# EAGLE design Wifi Topside Adapter 0.1 (EAGLE 6.5.0)
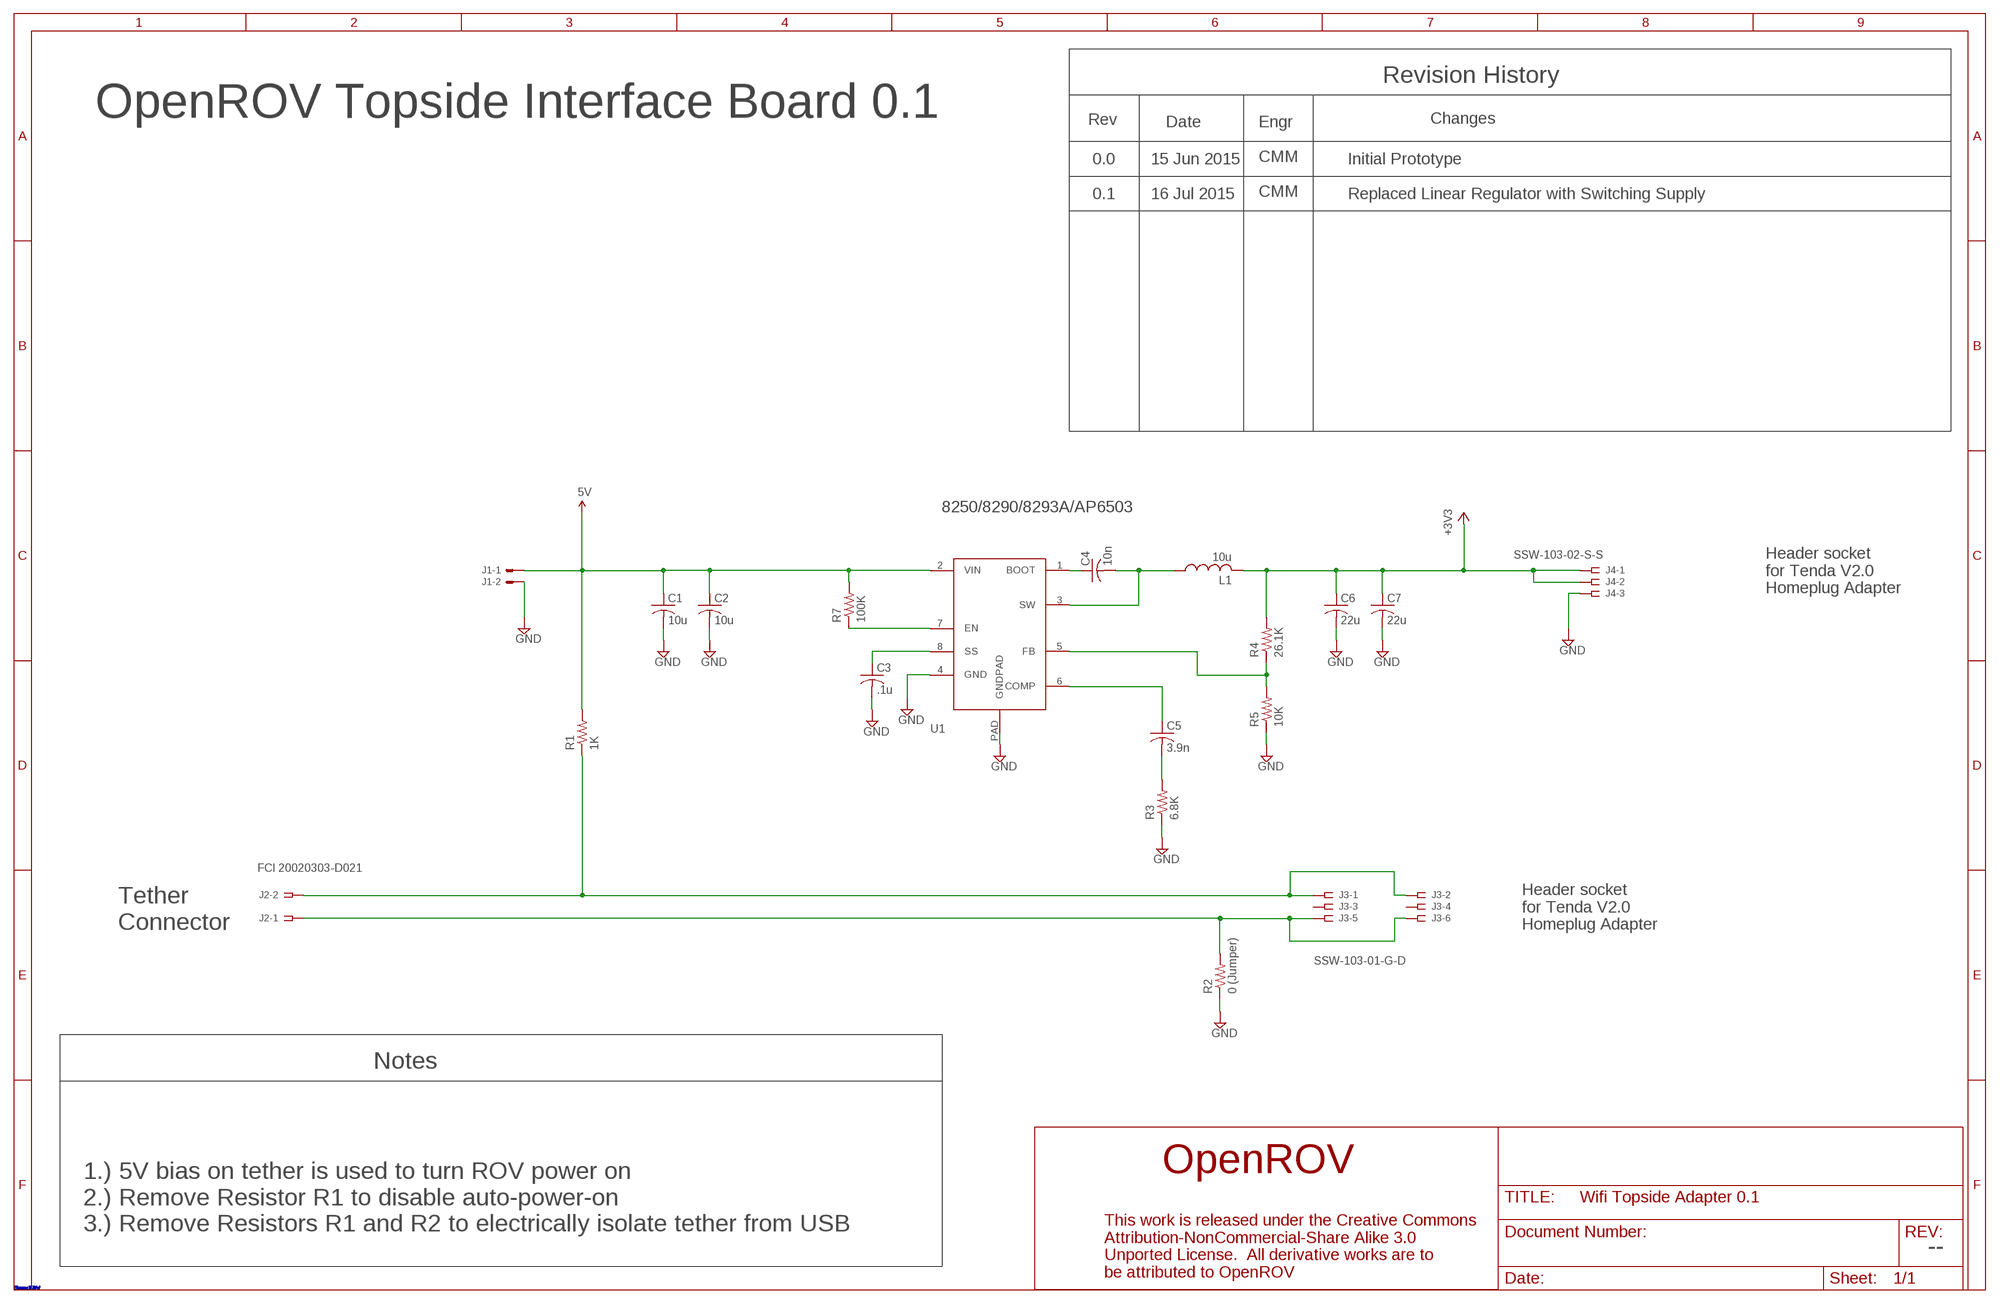
[diagram p0: schematic, sheet 1]

## Parts
C1  10u  CAP1206  [R1206]
C2  10u  CAP1206  [R1206]
C3  .1u  CAP0805  [R0805]
C4  10n  CAP0805  [R0805]
C5  3.9n  CAP0805  [R0805]
C6  22u  CAP1206  [R1206]
C7  22u  CAP1206  [R1206]
J1  HDR_1X2X0.100-ALT_SILK  [22-23-2021_ALT_SILK]
J2  FCI 20020303-D021  FCI_TERMINAL_BLOCK_2PL  [FCI_09-381_2PL]
J3  SSW-103-01-G-D  HDR_SOCKET_2X3  [SSW-103-02-S-D]
J4  SSW-103-02-S-S  [SSW-103-02-S-S]
L1  10u  INDUCTOR3A_TEST  [INDUCTOR_3A_TEST]
R1  1K  RESISTOR-0805  [R0805]
R2  0 (Jumper)  RESISTOR-0805  [R0805]
R3  6.8K  RESISTOR-0805  [R0805]
R4  26.1K  RESISTOR-0805  [R0805]
R5  10K  RESISTOR-0805  [R0805]
R7  100K  RESISTOR-0805  [R0805]
U1  RICHTEK_82XX  [SO8-THERMAL]

## Nets
5V: C1.1 C2.1 J1.1 R1.2 R7.2 U1.2(VIN)
+3V3: C6.1 C7.1 J4.1 J4.2 L1.P$2 R4.2
GND: C1.2 C2.2 C3.2 C6.2 C7.2 J1.2 J4.3 R2.1 R3.1 R5.1 U1.4(GND) U1.PAD(GNDPAD)
N$1: J2.1A J2.1B J3.5 J3.6 R2.2
N$2: J2.2A J2.2B J3.1 J3.2 R1.1
N$9: C3.1 U1.8(SS)
N$11: C5.1 U1.6(COMP)
N$12: C5.2 R3.2
N$13: R4.1 R5.2 U1.5(FB)
N$14: C4.1 U1.1(BOOT)
N$15: R7.1 U1.7(EN)
N$17: C4.2 L1.P$1 U1.3(SW)
Unconnected: J3.3 J3.4

## Notes on the sheet
- Revision History
- OpenROV Topside Interface Board 0.1
- Rev | Date | Engr | Changes
- 0.0 | 15 Jun 2015 | CMM | Initial Prototype
- 0.1 | 16 Jul 2015 | CMM | Replaced Linear Regulator with Switching Supply
- 8250/8290/8293A/AP6503
- Header socket
  for Tenda V2.0
  Homeplug Adapter
- Tether
  Connector
- Header socket
  for Tenda V2.0
  Homeplug Adapter
- Notes
- 1.) 5V bias on tether is used to turn ROV power on
  2.) Remove Resistor R1 to disable auto-power-on
  3.) Remove Resistors R1 and R2 to electrically isolate tether from USB
- --
- /Users/careymccachern/Desktop/openrov-logo-silkscreen.bmp

## Library data of the parts
C1-C7 = Walts_Generic_Parts:CAP: Generic Non-Polarized Capacitor
J1 = Walts Generic Connectors:HDR_1X2X0.100: .100" (2.54mm) Center Header - 2 Pin Derived from Molex 22-23-2021
J2 = OpenROV Topside Interface:FCI_TERMINAL_BLOCK_2PL: FCI 2-place Terminal Block 09-381 / 20020303
J3 = OpenROV Topside Interface:HDR_SOCKET_2X3: 2X3 THROUGH-HOLE .025" SQ POST SOCKET Based upon Samtec SSW-103-02-S-D; MPN: SSW-103-02-S-D; OC_FARNELL: unknown; OC_NEWARK: 11P9365
J4 = con-samtec:SSW-103-02-S-S: THROUGH-HOLE .025" SQ POST SOCKET Source: Samtec SSW.pdf; MPN: SSW-103-02-S-S; OC_FARNELL: unknown; OC_NEWARK: 11P9367
L1 = Walts_Generic_Parts:INDUCTOR
R1-R5 R7 = Walts_Generic_Parts:RESISTOR: Generic Resistor
U1 = Walts Power Supply Components:RICHTEK_82XX: Richtek 82XX-series synchronous buck converter in SO-8 package

## Board
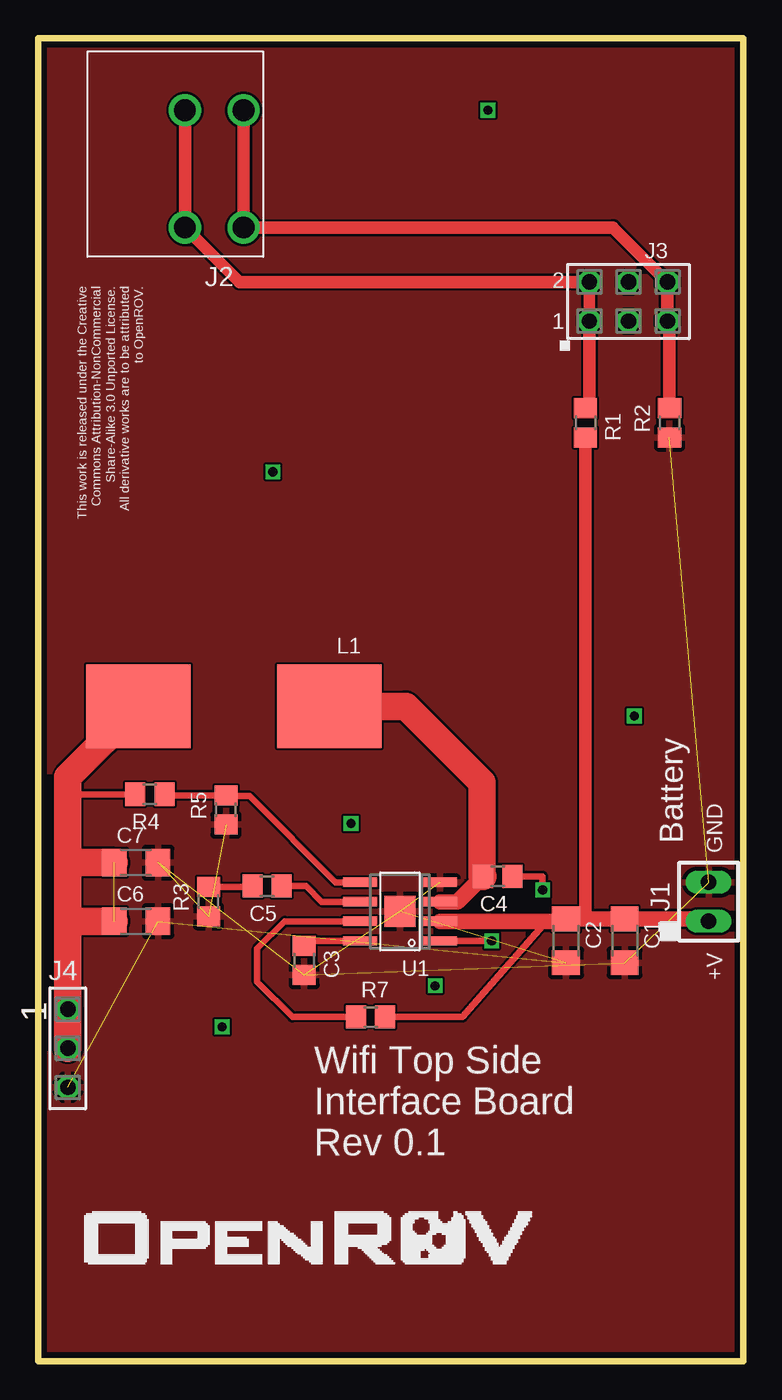
[diagram p1: board, top side]
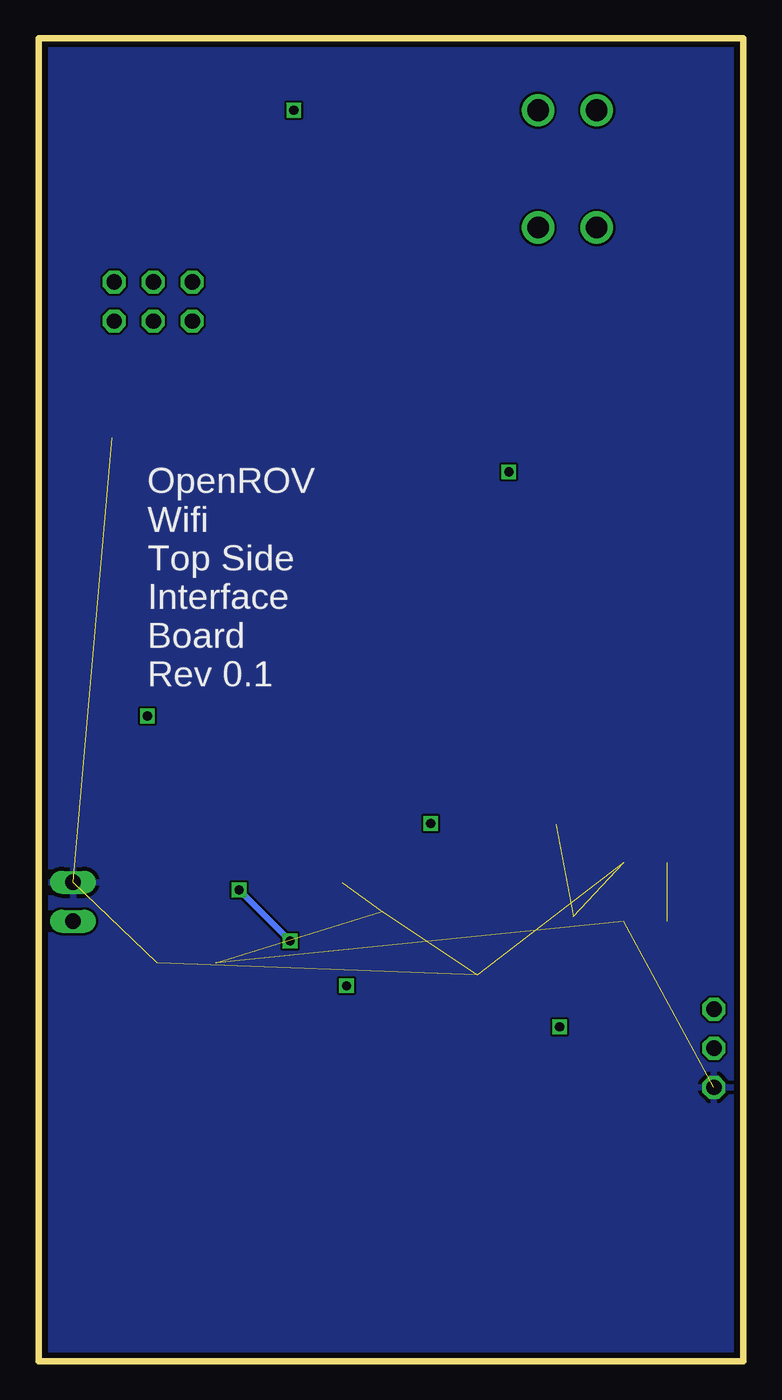
[diagram p2: board, bottom side, seen from below]

Size 45.81 x 85.94 mm. Coordinates in mm from the lower left corner, seen from the top.
Outline: 0,0 0,85.94 45.81,85.94 45.81,0 0,0
Copper layers (1*16): Top 0.0356mm / dielectric 1.5011mm / Bottom 0.0356mm
Design rules "LaenPCBOrder": minimum track width 6mil, minimum drill 13mil, track to track 6mil, track to pad 6mil, pad to pad 6mil, via to via 6mil, smd to smd 6mil, copper to edge 15mil, drill to drill 6mil, minimum pad ring 7mil, minimum via ring 7mil, stop-mask expansion 3mil, vias tented up to drill 0mil, thermal gap 10mil

### Footprints (pad centres in the part's own frame; a part is rotated, then mirrored left to right if it is on the bottom)
R1206 = smd 1.6 x 1.803: 1 -1.422,0; 2 1.422,0
R0805 = smd 1.3 x 1.5: 1 -0.95,0; 2 0.95,0
22-23-2021_ALT_SILK = drill 1 long: 1 -1.27,0; 2 1.27,0
FCI_09-381_2PL = drill 1.4: 1A -1.905,-3.81; 1B -1.905,3.81; 2A 1.905,-3.81; 2B 1.905,3.81
SSW-103-02-S-D = drill 1 pad 1.5 octagon: 1 -2.54,-1.27; 2 -2.54,1.27; 3 0,-1.27; 4 0,1.27; 5 2.54,-1.27; 6 2.54,1.27
SSW-103-02-S-S = drill 1 pad 1.5 octagon: 1 -2.54,0; 2 0,0; 3 2.54,0
INDUCTOR_3A_TEST = smd 6.8 x 5.4: P$1 -6.2,0; P$2 6.2,0
SO8-THERMAL = smd 0.6 x 2.2: 1 -1.905,-2.6; 2 -0.635,-2.6; 3 0.635,-2.6; 4 1.905,-2.6; 5 1.905,2.6; 6 0.635,2.6; 7 -0.635,2.6; 8 -1.905,2.6 | smd 2.032 x 2.032: PAD 0,0

### Placement (x,y rotation side)
C1  38.1,27.3 270 top
C2  34.29,27.3 270 top
C3  17.27,26.04 270 top
C4  29.84,31.5 180 top
C5  14.86,30.86 180 top
C6  6.35,28.57 0 top
C7  6.35,32.38 0 top
J1  43.56,29.84 90 top
J2  11.43,77.47 180 top
J3  38.35,68.84 0 top
J4  1.91,20.32 270 top
L1  12.7,42.55 180 top
R1  35.56,60.96 270 top
R2  41.02,60.96 90 top
R3  11.05,29.84 90 top
R4  7.24,36.83 180 top
R5  12.19,35.81 90 top
R7  21.59,22.35 0 top
U1  23.5,29.21 90 top

### Tracks (layer width: path | path; a pad name or v marks a point on that pad's centre or on a via)
5V
  Top 0.406: R7.2 27.56,22.35 33.02,28.57
  Top 0.813: R1.2 35.56,28.73
  Top 1.016: U1.2 33.02,28.57 34.14,28.57 C2.1 35.56,28.73 C1.1 43.41,28.73 J1.1
+3V3  (1 unrouted)
  Top 0.406: R4.2 1.91,36.83
  Top 1.778: 1.91,28.57 J4.1 J4.2 | 1.91,28.57 1.91,36.83 1.91,37.95 L1.P$2 | C7.1 2.54,32.38 | C6.1 1.91,28.57
GND  (11 unrouted)
  pour Bottom: 0,0 0,85.72 45.72,85.72 45.72,0
  pour Top (rank 2): 0,85.72 45.72,85.72 45.72,0 0,0
N$1
  Top 0.813: R2.2 41.02,67.44 J3.5 J3.6 37.34,73.66 J2.1B J2.1A
N$2
  Top 0.762: J3.2 J3.1
  Top 0.813: J3.1 35.81,62.16 R1.1 | J3.2 13.07,70.11 J2.2B J2.2A
N$3  (via drill 0.6)
  other vias: 20.32,34.92
N$4  (via drill 0.6)
  other vias: 11.94,21.72
N$5  (via drill 0.6)
  other vias: 25.78,24.38
N$6  (via drill 0.6)
  other vias: 15.24,57.78
N$7  (via drill 0.6)
  other vias: 38.73,41.91
N$8  (via drill 0.6)
  other vias: 29.21,81.28
N$9
  Top 0.406: U1.8 17.59,27.3 C3.1
N$11
  Top 0.406: C5.1 17.4,30.86 18.41,29.84 U1.6
N$12
  Top 0.406: R3.2 13.84,30.8 C5.2
N$13
  Top 0.406: U1.5 19.3,31.11 13.72,36.7 12.25,36.7 R5.2 8.26,36.76 R4.1
N$14  (via drill 0.6)
  Top 0.406: U1.1 v29.46,27.3 | v32.77,30.61 32.77,31.5 C4.1
  Bottom 0.406: v29.46,27.3 v32.77,30.61
N$15
  Top 0.406: R7.1 16.51,22.35 14.22,24.64 14.22,26.8 16,28.57 U1.7
N$17
  Top 1.016: U1.3 27.24,29.84 C4.2
  Top 1.778: L1.P$1 23.88,42.55 28.83,37.59 28.83,31.56 C4.2

### Text on the board
tPlace: This work is released under the Creative / Commons Attribution-NonCommercial / Share-Alike 3.0 Unported License. / All derivative works are to be attributed / to OpenROV.
_tsilk: Battery | GND | +V | Wifi Top Side / Interface Board / Rev 0.1
_bsilk: OpenROV / Wifi / Top Side / Interface / Board / Rev 0.1